# Altium schematic sheet SOC CSI Camera.SchDoc
size A3
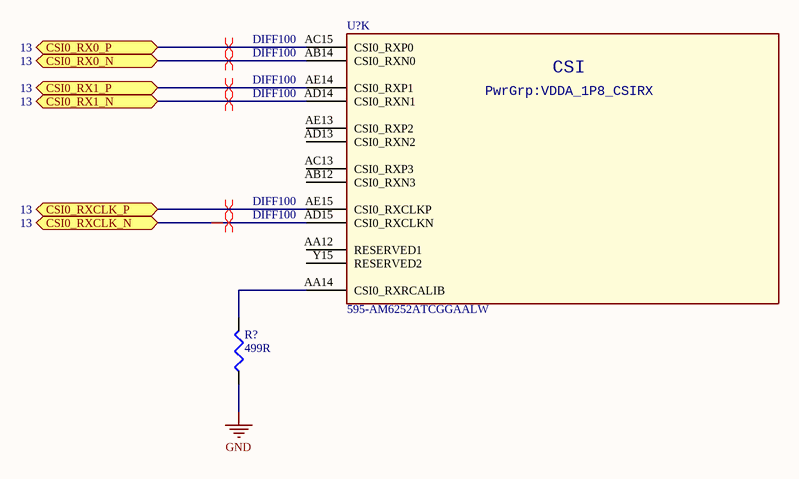
[diagram p0: SOC CSI Camera.SchDoc]

## Parts
R?  499R  [R0402]
U?  Supplier Part Number 1: 595-AM6252ATCGGAALW  [BGA425C50P25X25_1300X1300X89]  (hidden comment: AM62-EVM_BGA425)  (part K of 18)

## Ports
CSI0_RX0_N (bidir, see 13), CSI0_RX0_P (bidir, see 13), CSI0_RX1_N (bidir, see 13), CSI0_RX1_P (bidir, see 13), CSI0_RXCLK_N (bidir, see 13), CSI0_RXCLK_P (bidir, see 13)

## Nets
GND: R?.1
CSI0_RX0_N: U?.AB14(CSI0_RXN0) ; port CSI0_RX0_N
CSI0_RX0_P: U?.AC15(CSI0_RXP0) ; port CSI0_RX0_P
CSI0_RX1_N: U?.AD14(CSI0_RXN1) ; port CSI0_RX1_N
CSI0_RX1_P: U?.AE14(CSI0_RXP1) ; port CSI0_RX1_P
CSI0_RXCLK_N: U?.AD15(CSI0_RXCLKN) ; port CSI0_RXCLK_N
CSI0_RXCLK_P: U?.AE15(CSI0_RXCLKP) ; port CSI0_RXCLK_P
NetR?_2: R?.2 U?.AA14(CSI0_RXRCALIB)

Not connected (* = marked no-connect by the designer): U? AA12(RESERVED1) AB12(CSI0_RXN3) AC13(CSI0_RXP3) AD13(CSI0_RXN2) AE13(CSI0_RXP2) Y15(RESERVED2)

## Layout directives
differential pair; net class DIFF100: CSI0_RX0_N, CSI0_RX0_P, CSI0_RX1_N, CSI0_RX1_P, CSI0_RXCLK_N, CSI0_RXCLK_P

## Notes on the sheet
- (in symbol AM62-EVM_BGA425, part K) CSI; PwrGrp:VDDA_1P8_CSIRX

## Library data of the parts
R? = RT0402BRD07499RL: RES SMD 499 OHM 0.1% 1/16W 0402; Manufacturer: Yageo; Power Rating: 62.5mW; Voltage Rating: 50V; Max Power Dissipation: 63mW; Temperature Coefficient: 25ppm/°C; Supplier 1: Digi-Key; Manufacturer Part Number: RT0402BRD07499RL; Stock 1: 20000; Pricing 1: 10000=0.0411, 30000=0.0391, 50000=0.0383, 100000=0.0375 (USD); Case/Package: 0402; Case Code (Metric): 1005; Case Code (Imperial): 0402; Size Code: 0402; Min Operating Temperature: -55°C; Max Operating Temperature: 155°C; Package Quantity: 10000; Packaging: Tape and Reel; Resistance: 499R; Tolerance: 0.1%; Resistor Type: Thin Film; Number of Terminations: 2; Termination: SMD/SMT; Voltage Rating (DC): 50V; Features: Moisture Resistant; Series: RT; Length: 0.039inch; Width: 0.02inch; Height: 0.014inch; Lead Free: Lead Free; RoHS Compliant: Yes; ComponentLink1URL: https://datasheet.ciiva.com/12724/pyu-rt-1-to-0-05-rohs-l-4-12724797.pdf?src-supplier=Mouser; ComponentLink1Description: https://datasheet.ciiva.com/12724/pyu-rt-1-to-0-05-rohs-l-4-12724797.pdf?src-supplier=Mouser; ComponentLink2URL: https://datasheet.ciiva.com/2582/pyu-rt-1-to-0-05-rohs-l-4-2582397.pdf?src-supplier=Digi-Key; ComponentLink2Description: https://datasheet.ciiva.com/2582/pyu-rt-1-to-0-05-rohs-l-4-2582397.pdf?src-supplier=Digi-Key; ComponentLink3URL: https://datasheet.ciiva.com/46635/pyu-rt-1-to-0-05-rohs-l-5-46635222.pdf?src-supplier=Digi-Key; ComponentLink3Description: https://datasheet.ciiva.com/46635/pyu-rt-1-to-0-05-rohs-l-5-46635222.pdf?src-supplier=Digi-Key; Supplier Part Number 1: YAG1440TR-ND
U? = AM62-EVM_BGA425: ARM® Cortex®-A53 Microprocessor IC Sitara™ 2 Core, 64-Bit 1.4GHz 425-FCCSP (13x13); Manufacturer: Texas Instruments; Manufacturer Part Number: AM6252ATCGGAALW; Supplier 1: Mouser; Stock 1: 0; Pricing 1: 1=21.23, 10=19.58, 50=18.7, 100=18.7, 1000=15.94, 10000=15.94 (USD)